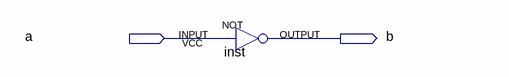
[diagram p0: schematic sheet]
// Quartus schematic not_el.bdf as structural Verilog: 1 symbols, 2 pins
module not_el (
  input  a,
  output b
);

  not inst (b, a);
endmodule
